# EAGLE schematic RPi Hat_V0 (EAGLE 7.2.0)
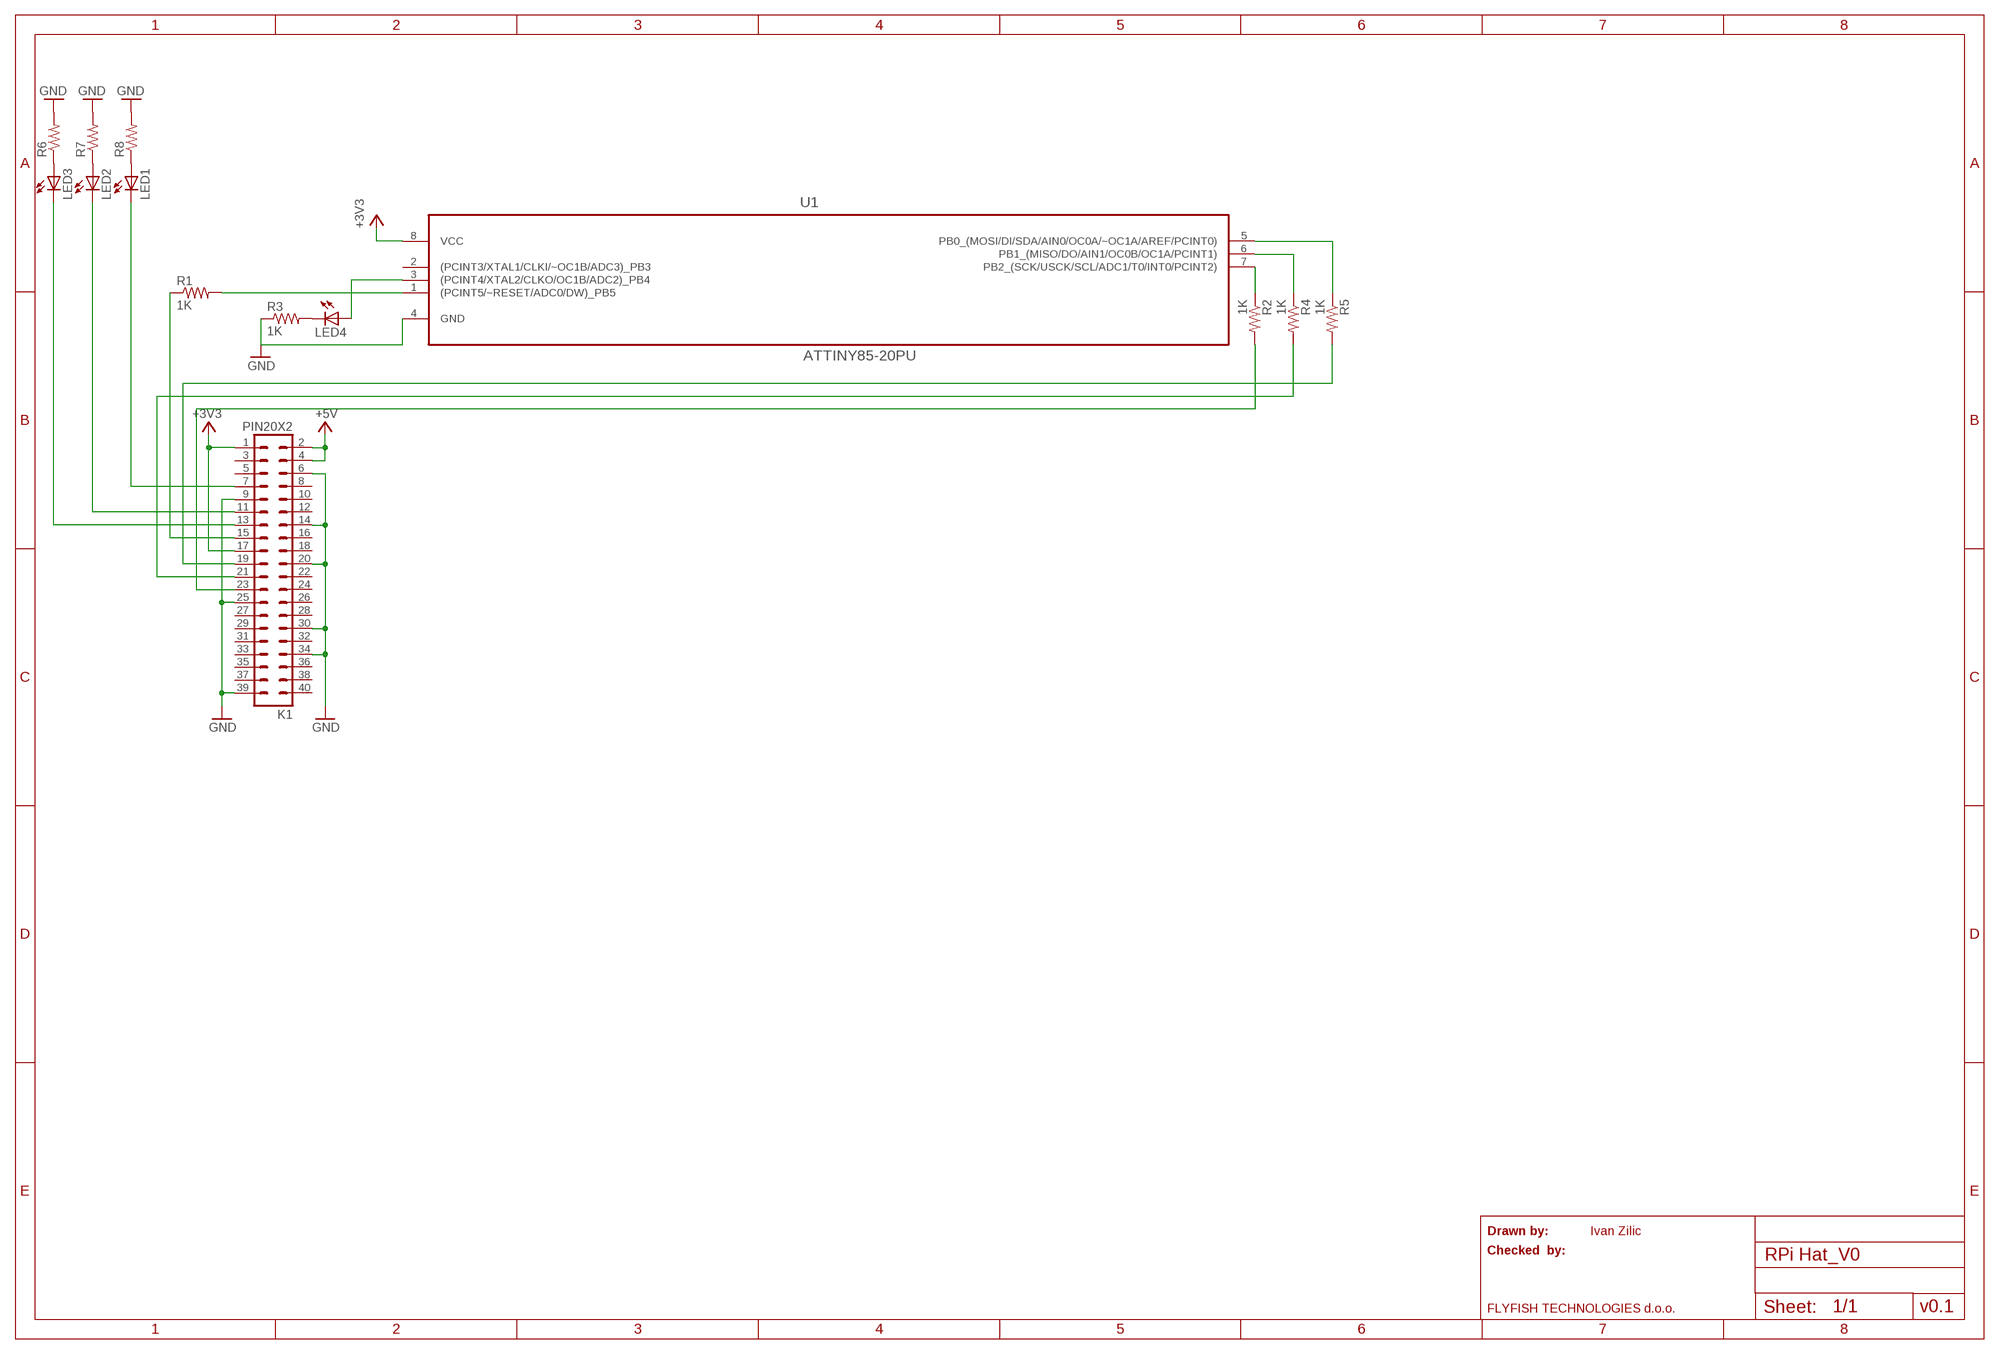
[diagram p0: schematic, sheet 1]

## Parts
K1  PIN20X2  [PIN_20X2]
LED1  LED3MM  [LED3MM]
LED2  LED3MM  [LED3MM]
LED3  LED3MM  [LED3MM]
LED4  LED3MM  [LED3MM]
R1  1K  R-US_0204/5  [0204/5]
R2  1K  R-US_0204/5  [0204/5]
R3  1K  R-US_0204/5  [0204/5]
R4  1K  R-US_0204/5  [0204/5]
R5  1K  R-US_0204/5  [0204/5]
R6  R-US_0204/5  [0204/5]
R7  R-US_0204/5  [0204/5]
R8  R-US_0204/5  [0204/5]
U1  ATTINY85-20PU  [DIP254P762X533-8]

## Nets
+3V3: K1.1 K1.17
+5V: K1.2 K1.4
GND: K1.6 K1.9 K1.14 K1.20 K1.25 K1.30 K1.34 K1.39 R3.1 R6.2 R7.2 R8.2 U1.4(GND)
N$1: K1.15 R1.1
N$2: R1.2 U1.1((PCINT5/~RESET/ADC0/DW)_PB5)
N$3: K1.19 R5.2
N$4: R2.1 U1.7(PB2_(SCK/USCK/SCL/ADC1/T0/INT0/PCINT2))
N$5: R4.1 U1.6(PB1_(MISO/DO/AIN1/OC0B/OC1A/PCINT1))
N$6: K1.21 R4.2
N$7: R5.1 U1.5(PB0_(MOSI/DI/SDA/AIN0/OC0A/~OC1A/AREF/PCINT0))
N$8: K1.23 R2.2
N$9: LED4.K(C) R3.2
N$10: LED4.A U1.3((PCINT4/XTAL2/CLKO/OC1B/ADC2)_PB4)
N$11: K1.7 LED1.K(C)
N$12: K1.11 LED2.K(C)
N$13: K1.13 LED3.K(C)
N$14: LED3.A R6.1
N$15: LED2.A R7.1
N$16: LED1.A R8.1
VCC: U1.8(VCC) ; supply symbol labelled +3V3
Unconnected: K1.3 K1.5 K1.8 K1.10 K1.12 K1.16 K1.18 K1.22 K1.24 K1.26 K1.27 K1.28 K1.29 K1.31 K1.32 K1.33 K1.35 K1.36 K1.37 K1.38 K1.40 U1.2((PCINT3/XTAL1/CLKI/~OC1B/ADC3)_PB3)

## Notes on the sheet
- Drawn by: | Ivan Zilic
- Checked  by:
- FLYFISH TECHNOLOGIES d.o.o. | v0.1

## Library data of the parts
K1 = FLYFISH:PIN20X2
LED1-LED4 = adafruit:LED: LED OSRAM: - CHIPLED LG R971, LG N971, LY N971, LG Q971, LY Q971, LO R971, LY R971 LH N974, LH R974 LS Q976, LO Q976, LY Q976 LO Q996 - Hyper CHIPLED LW Q18S LB Q993, LB Q99A, LB R99A - SideLED LS A670, LO A670, LY A670, LG A670, LP A670 LB A673, LV A673, LT A673, LW A673 LH A674 LY A675 LS A676, LA A676, LO A676, LY A676, LW A676 LS A679, LY A679, LG A679 - Hyper Micro SIDELED® LS Y876, LA Y876, LO Y876, LY Y876 LT Y87S - SmartLED LW L88C, LW L88S LB L89C, LB L89S, LG L890 LS L89K, LO L89K, LY L89K LS L896, LA L896, LO L896, LY L896 - TOPLED LS T670, LO T670, LY T670, LG T670, LP T670 LSG T670, LSP T670, LSY T670, LOP T670, LYG T670 LG T671, LOG T671, LSG T671 LB T673, LV T673, LT T673, LW T673 LH T674 LS T676, LA T676, LO T676, LY T676, LB T676, LH T676, LSB T676, LW T676 LB T67C, LV T67C, LT T67C, LS T67K, LO T67K, LY T67K, LW E67C LS E67B, LA E67B, LO E67B, LY E67B, LB E67C, LV E67C, LT E67C LW T67C LS T679, LY T679, LG T679 LS T770, LO T770, LY T770, LG T770, LP T770 LB T773, LV T773, LT T773, LW T773 LH T774 LS E675, LA E675, LY E675, LS T675 LS T776, LA T776, LO T776, LY T776, LB T776 LHGB T686 LT T68C, LB T68C - Hyper Mini TOPLED® LB M676 - Mini TOPLED Santana® LG M470 LS M47K, LO M47K, LY M47K Source: http://www.osram.convergy.de/
R1-R8 = adafruit:R-US_: RESISTOR, American symbol
U1 = Atmel_By_element14_Batch_1-00:ATTINY85-20PU: 8-bit Microcontroller with In-System Programmable Flash; MPN: ATTINY85-20PU; OC_FARNELL: 1455162; OC_NEWARK: 58M3796; PACKAGE: PDIP-8; SUPPLIER: Atmel